# EAGLE design BQ2970_circuit (EAGLE 9.5.2)
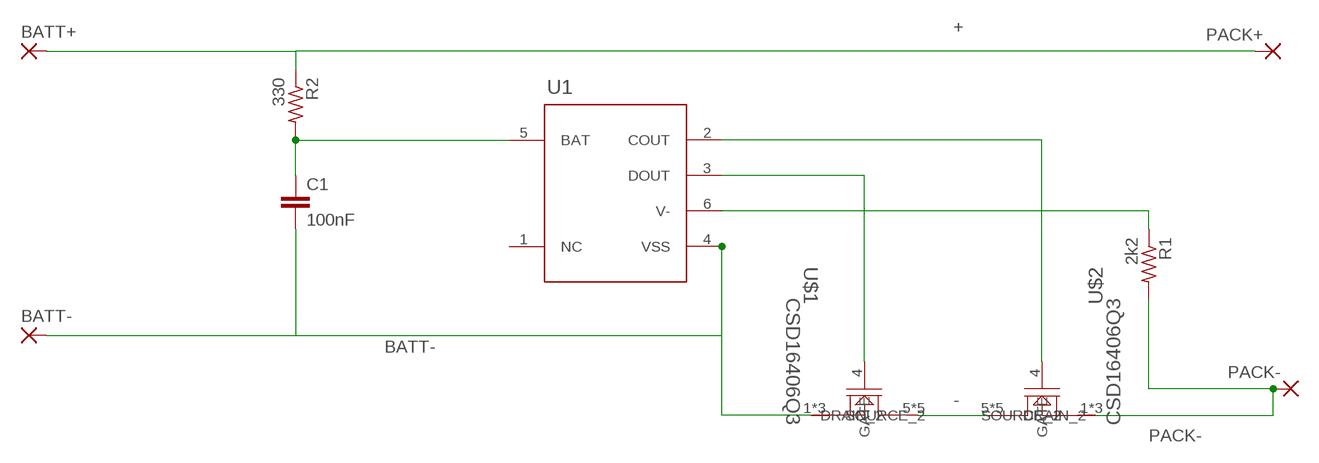
[diagram p0: schematic, sheet 1]

## Parts
BATT+  SMD5  [SMD2,54-5,08]
BATT-  SMD5  [SMD2,54-5,08]
C1  100nF  C-EUC0805  [C0805]
PACK+  SMD5  [SMD2,54-5,08]
PACK-  SMD5  [SMD2,54-5,08]
R1  2k2  R-US_R0805  [R0805]
R2  330  R-US_R0805  [R0805]
U1  Value  BQ29700DSER  [DSE0006A]
U$1  CSD16406Q3  [DQG0008A]
U$2  CSD16406Q3  [DQG0008A]

## Nets
+: BATT+.1(P) PACK+.1(P) R2.1
-: U$1.5(DRAIN_2) U$1.6(DRAIN_2) U$1.7(DRAIN_2) U$1.8(DRAIN_2) U$1.9(DRAIN_2) U$2.5(DRAIN_2) U$2.6(DRAIN_2) U$2.7(DRAIN_2) U$2.8(DRAIN_2) U$2.9(DRAIN_2)
BATT-: BATT-.1(P) C1.2 U1.4(VSS) U$1.1(SOURCE_2) U$1.2(SOURCE_2) U$1.3(SOURCE_2)
N$2: C1.1 R2.2 U1.5(BAT)
N$5: R1.1 U1.6(V-)
N$6: U1.2(COUT) U$2.4(GATE)
N$7: U1.3(DOUT) U$1.4(GATE)
PACK-: PACK-.1(P) R1.2 U$2.1(SOURCE_2) U$2.2(SOURCE_2) U$2.3(SOURCE_2)
Unconnected: U1.1(NC)

## Library data of the parts
BATT+ BATT- PACK+ PACK- = wirepad:SMD5: SMD PAD
C1 = rcl:C-EU: CAPACITOR, European symbol; SPICEPREFIX: C
R1 R2 = rcl:R-US_: RESISTOR, American symbol; SPICEPREFIX: R
U1 = BQ2970:BQ29700DSER; MANUFACTURER: Texas Instruments; PARTNUMBER: BQ29705DSER; REFDES: RefDes; TYPE: TYPE
U$1 U$2 = CSD16406Q3:CSD16406Q3; DATASHEET_URL: http://www.ti.com/lit/ds/symlink/csd16406q3.pdf; IDSMAX: 60.0; MANUFACTURER_PART_NUMBER: CSD16406Q3; QGTYP: 5.8; QUANTITY: 1; RDSON45: 0.0059; VDSMAX: 25.0; VENDOR: Texas Instruments

## Board
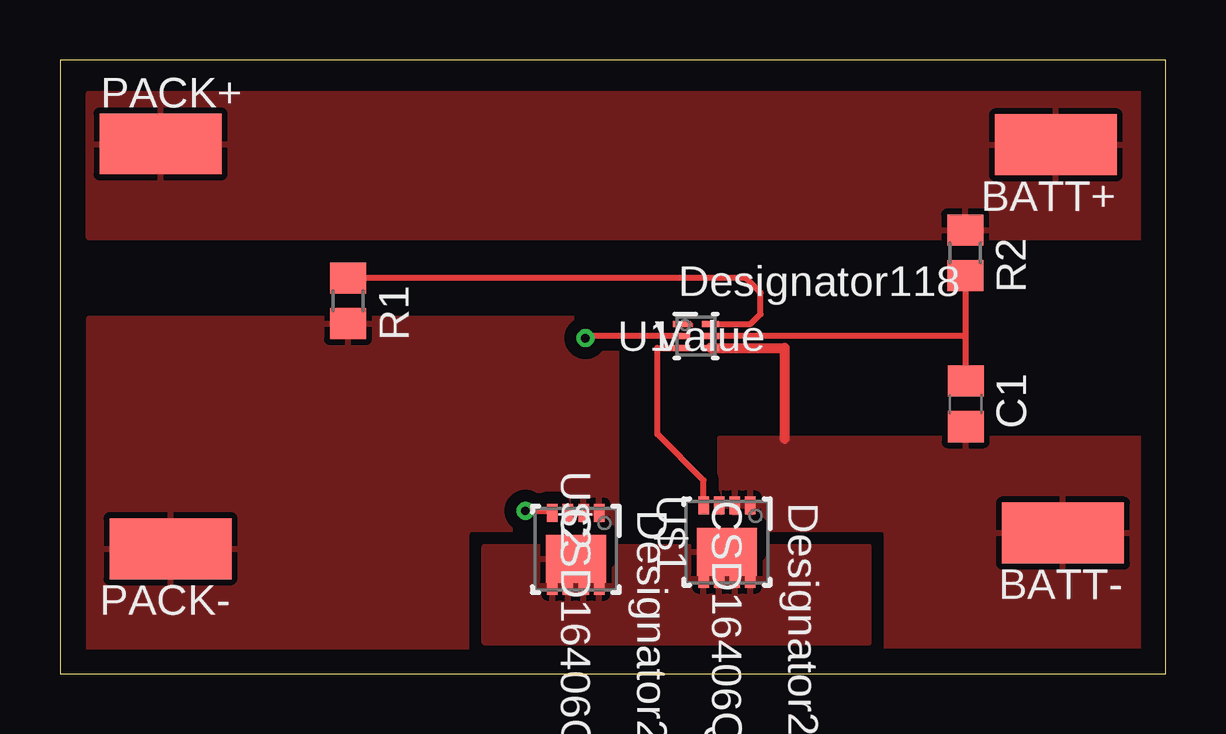
[diagram p1: board, top side]
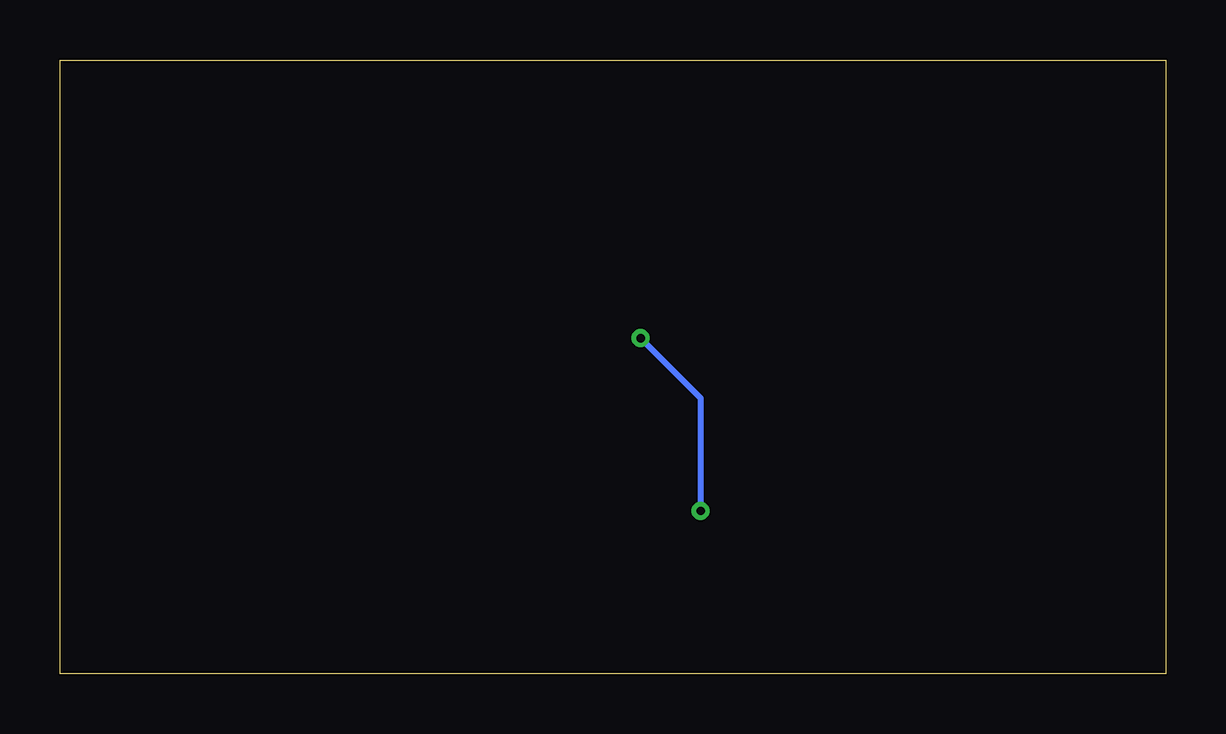
[diagram p2: board, bottom side, seen from below]

Size 46.1 x 25.6 mm. Coordinates in mm from the lower left corner, seen from the top.
Outline: 0,0 46.1,0 46.1,25.6 0,25.6 0,0
Copper layers (1*16): Top 0.035mm / dielectric 1.5mm / Bottom 0.035mm
Design rules "default": minimum track width 6mil, minimum drill 0.35mm, track to track 6mil, track to pad 6mil, pad to pad 6mil, via to via 6mil, smd to smd 6mil, copper to edge 40mil, drill to drill 6mil, minimum pad ring 10mil, minimum via ring 8mil, stop-mask expansion 4mil, vias tented up to drill 0mil, thermal gap 10mil

### Footprints (pad centres in the part's own frame; a part is rotated, then mirrored left to right if it is on the bottom)
SMD2,54-5,08 = smd 2.54 x 5.08: 1 0,0
C0805 = smd 1.3 x 1.5: 1 -0.95,0; 2 0.95,0
R0805 = smd 1.3 x 1.5: 1 -0.95,0; 2 0.95,0
DSE0006A = smd 0.66 x 0.25: 1 -0.62,0.5 | smd 0.7 x 0.25: 2 -0.6,0; 3 -0.6,-0.5; 4 0.6,-0.5; 5 0.6,0; 6 0.6,0.5
DQG0008A = smd 0.75 x 0.44: 1 -1.525,0.975; 2 -1.525,0.325; 3 -1.525,-0.325; 4 -1.525,-0.975; 5 1.525,-0.975; 6 1.525,-0.325; 7 1.525,0.325; 8 1.525,0.975 | smd 2 x 2.5: 9 0.4,0 | smd 0.5 x 0.5: V 0.226,0.975

### Placement (x,y rotation side)
BATT+  41.51,22.06 90 top
BATT-  41.81,5.88 90 top
C1  37.75,11.26 270 top
PACK+  4.19,22.1 270 top
PACK-  4.61,5.22 90 top
R1  12.01,15.56 270 top
R2  37.73,17.56 270 top
U1  26.51,14.09 0 top
U$1  27.8,5.5 270 top
U$2  21.5,5.2 270 top

### Tracks (layer width: path | path; a pad name or v marks a point on that pad's centre or on a via)
+
  pour Top (isolate 0.35): 1.2,24.2 45.2,24.2 45.2,18.2 1.2,18.2
-
  pour Top (isolate 0.5): 17.7,5.3 33.7,5.3 33.7,1.3 17.7,1.3
BATT-
  Top 0.406: U1.4 30.2,13.59 30.2,9.8
  pour Top (isolate 0.5, rank 2): 27.5,9.8 27.5,5.8 34.2,5.8 34.2,1.2 45.2,1.2 45.2,9.8
N$2
  Top 0.254: C1.1 37.75,14.09 | 37.75,14.09 37.75,16.59 R2.2 | 37.75,14.09 U1.5
N$5
  Top 0.254: U1.6 28.79,14.59 29.2,15 29.2,15.9 28.59,16.51 R1.1
N$6  (via drill 0.35)
  Top 0.254: U1.2 21.99,14.09 v21.9,14 | v19.4,6.8 20.45,6.8 U$2.4
  Bottom 0.254: v21.9,14 19.4,11.5 v19.4,6.8
N$7
  Top 0.254: U1.3 24.9,13.59 24.9,10 26.82,8.08 U$1.4
PACK-
  pour Top (isolate 0.5, rank 2): 1.2,14.8 1.2,0.8 17.2,0.8 17.2,5.8 23.2,5.8 23.2,14.8